# EAGLE board UCirKitBreadboardBottom3 (EAGLE 7.3.0), part 1 of 3
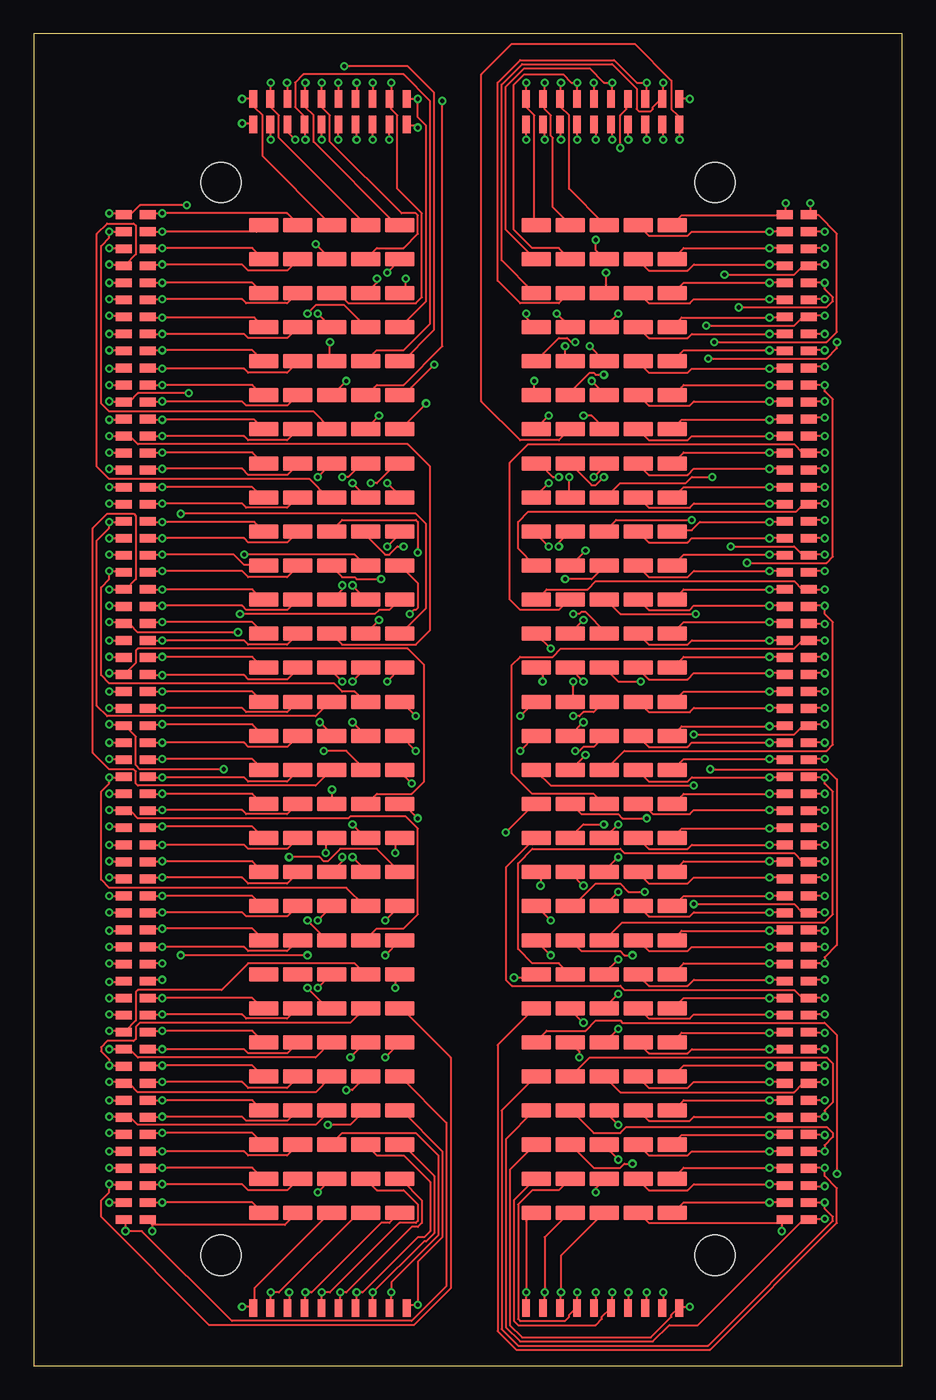
[diagram p5: board, top side]
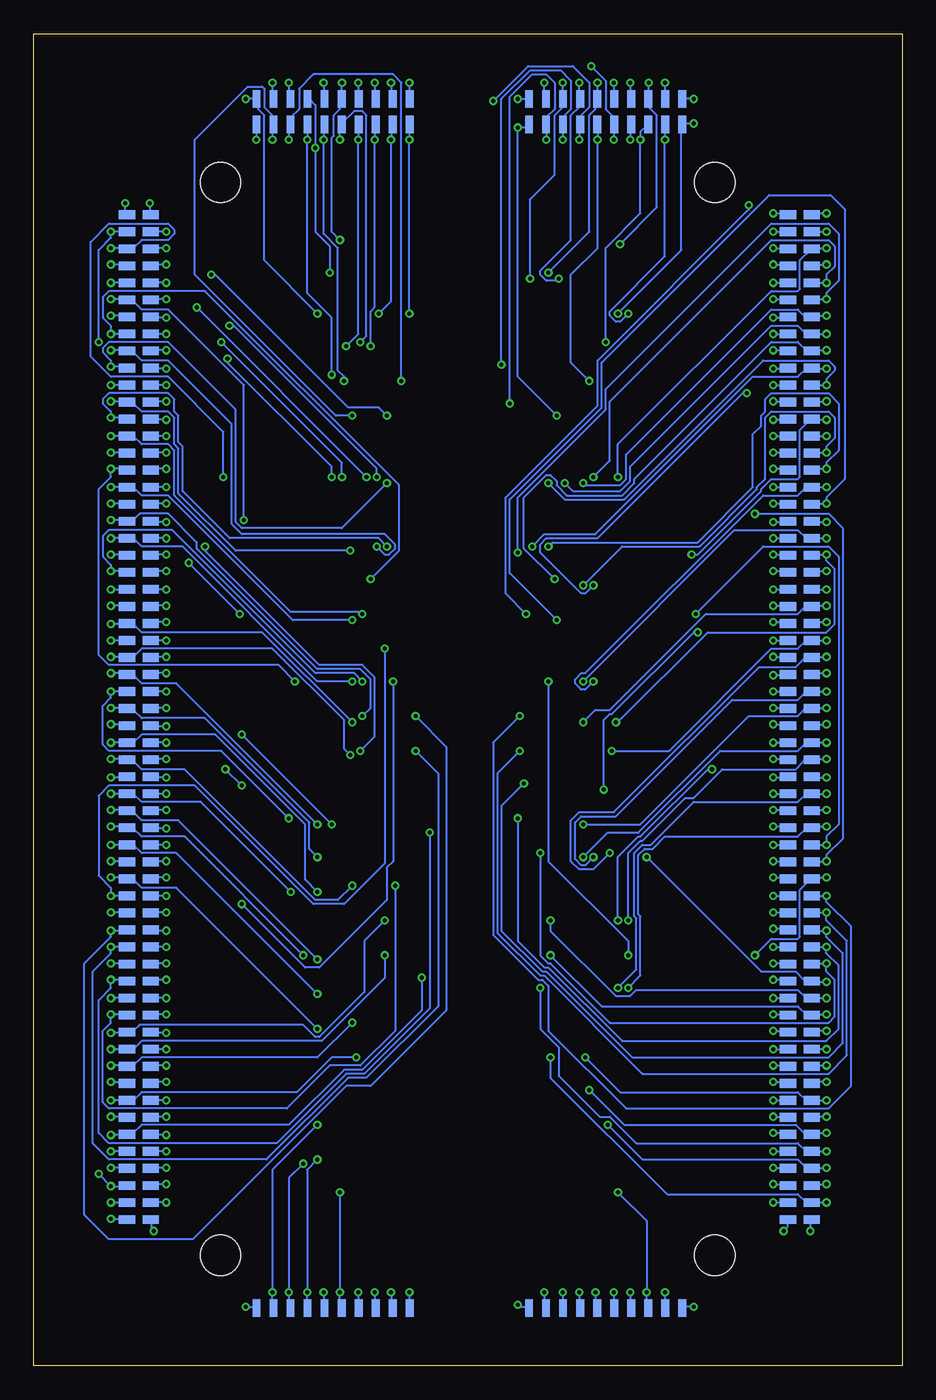
[diagram p6: board, bottom side, seen from below]

Size 64.75 x 99.36 mm. Coordinates in mm from the lower left corner, seen from the top.
Outline: 0,0 64.75,0 64.75,99.36 0,99.36 0,0
Copper layers (1*16): Top 0.035mm / dielectric 1.5mm / Bottom 0.035mm
Design rules "SeeedStudio_2layer_DRU_no_angle_20140221": minimum track width 6mil, minimum drill 12mil, track to track 6mil, track to pad 6mil, pad to pad 6mil, via to via 6mil, smd to smd 0mil, copper to edge 10mil, drill to drill 10mil, minimum pad ring 10mil, minimum via ring 6mil, stop-mask expansion 2mil, vias tented up to drill 100mil, thermal gap 10mil
Holes 3 mm at 13.97,88.27 50.8,88.27 13.97,8.26 50.8,8.26

## Footprints (pad centres in the part's own frame; a part is rotated, then mirrored left to right if it is on the bottom)
1X01_SMD_2.18X1.0668MM_NO_SILK = smd 2.184 x 1.067: P$2 0,0
1X01_SMD_1.27X0.635MM_NO_SILK = smd 1.27 x 0.635: P$2 0,0

## Placement (x,y rotation side)
JP301  [1X01_SMD_2.18X1.0668MM_NO_SILK]  17.14,85.09 0 top
JP302  [1X01_SMD_2.18X1.0668MM_NO_SILK]  19.68,85.09 0 top
JP303  [1X01_SMD_2.18X1.0668MM_NO_SILK]  22.23,85.09 0 top
JP304  [1X01_SMD_2.18X1.0668MM_NO_SILK]  24.77,85.09 0 top
JP305  [1X01_SMD_2.18X1.0668MM_NO_SILK]  27.3,85.09 0 top
JP306  [1X01_SMD_2.18X1.0668MM_NO_SILK]  37.47,85.09 0 top
JP307  [1X01_SMD_2.18X1.0668MM_NO_SILK]  40.01,85.09 0 top
JP308  [1X01_SMD_2.18X1.0668MM_NO_SILK]  42.55,85.09 0 top
JP309  [1X01_SMD_2.18X1.0668MM_NO_SILK]  45.09,85.09 0 top
JP310  [1X01_SMD_2.18X1.0668MM_NO_SILK]  47.62,85.09 0 top
JP311  [1X01_SMD_2.18X1.0668MM_NO_SILK]  17.14,82.55 0 top
JP312  [1X01_SMD_2.18X1.0668MM_NO_SILK]  19.68,82.55 0 top
JP313  [1X01_SMD_2.18X1.0668MM_NO_SILK]  22.23,82.55 0 top
JP314  [1X01_SMD_2.18X1.0668MM_NO_SILK]  24.77,82.55 0 top
JP315  [1X01_SMD_2.18X1.0668MM_NO_SILK]  27.3,82.55 0 top
JP316  [1X01_SMD_2.18X1.0668MM_NO_SILK]  37.47,82.55 0 top
JP317  [1X01_SMD_2.18X1.0668MM_NO_SILK]  40.01,82.55 0 top
JP318  [1X01_SMD_2.18X1.0668MM_NO_SILK]  42.55,82.55 0 top
JP319  [1X01_SMD_2.18X1.0668MM_NO_SILK]  45.09,82.55 0 top
JP320  [1X01_SMD_2.18X1.0668MM_NO_SILK]  47.62,82.55 0 top
JP321  [1X01_SMD_2.18X1.0668MM_NO_SILK]  17.14,80.01 0 top
JP322  [1X01_SMD_2.18X1.0668MM_NO_SILK]  19.68,80.01 0 top
JP323  [1X01_SMD_2.18X1.0668MM_NO_SILK]  22.23,80.01 0 top
JP324  [1X01_SMD_2.18X1.0668MM_NO_SILK]  24.77,80.01 0 top
JP325  [1X01_SMD_2.18X1.0668MM_NO_SILK]  27.3,80.01 0 top
JP326  [1X01_SMD_2.18X1.0668MM_NO_SILK]  37.47,80.01 0 top
JP327  [1X01_SMD_2.18X1.0668MM_NO_SILK]  40.01,80.01 0 top
JP328  [1X01_SMD_2.18X1.0668MM_NO_SILK]  42.55,80.01 0 top
JP329  [1X01_SMD_2.18X1.0668MM_NO_SILK]  45.09,80.01 0 top
JP330  [1X01_SMD_2.18X1.0668MM_NO_SILK]  47.62,80.01 0 top
JP331  [1X01_SMD_2.18X1.0668MM_NO_SILK]  17.14,77.47 0 top
JP332  [1X01_SMD_2.18X1.0668MM_NO_SILK]  19.68,77.47 0 top
JP333  [1X01_SMD_2.18X1.0668MM_NO_SILK]  22.23,77.47 0 top
JP334  [1X01_SMD_2.18X1.0668MM_NO_SILK]  24.77,77.47 0 top
JP335  [1X01_SMD_2.18X1.0668MM_NO_SILK]  27.3,77.47 0 top
JP336  [1X01_SMD_2.18X1.0668MM_NO_SILK]  37.47,77.47 0 top
JP337  [1X01_SMD_2.18X1.0668MM_NO_SILK]  40.01,77.47 0 top
JP338  [1X01_SMD_2.18X1.0668MM_NO_SILK]  42.55,77.47 0 top
JP339  [1X01_SMD_2.18X1.0668MM_NO_SILK]  45.09,77.47 0 top
JP340  [1X01_SMD_2.18X1.0668MM_NO_SILK]  47.62,77.47 0 top
JP341  [1X01_SMD_2.18X1.0668MM_NO_SILK]  17.14,74.93 0 top
JP342  [1X01_SMD_2.18X1.0668MM_NO_SILK]  19.68,74.93 0 top
JP343  [1X01_SMD_2.18X1.0668MM_NO_SILK]  22.23,74.93 0 top
JP344  [1X01_SMD_2.18X1.0668MM_NO_SILK]  24.77,74.93 0 top
JP345  [1X01_SMD_2.18X1.0668MM_NO_SILK]  27.3,74.93 0 top
JP346  [1X01_SMD_2.18X1.0668MM_NO_SILK]  37.47,74.93 0 top
JP347  [1X01_SMD_2.18X1.0668MM_NO_SILK]  40.01,74.93 0 top
JP348  [1X01_SMD_2.18X1.0668MM_NO_SILK]  42.55,74.93 0 top
JP349  [1X01_SMD_2.18X1.0668MM_NO_SILK]  45.09,74.93 0 top
JP350  [1X01_SMD_2.18X1.0668MM_NO_SILK]  47.62,74.93 0 top
JP351  [1X01_SMD_2.18X1.0668MM_NO_SILK]  17.14,72.39 0 top
JP352  [1X01_SMD_2.18X1.0668MM_NO_SILK]  19.68,72.39 0 top
JP353  [1X01_SMD_2.18X1.0668MM_NO_SILK]  22.23,72.39 0 top
JP354  [1X01_SMD_2.18X1.0668MM_NO_SILK]  24.77,72.39 0 top
JP355  [1X01_SMD_2.18X1.0668MM_NO_SILK]  27.3,72.39 0 top
JP356  [1X01_SMD_2.18X1.0668MM_NO_SILK]  37.47,72.39 0 top
JP357  [1X01_SMD_2.18X1.0668MM_NO_SILK]  40.01,72.39 0 top
JP358  [1X01_SMD_2.18X1.0668MM_NO_SILK]  42.55,72.39 0 top
JP359  [1X01_SMD_2.18X1.0668MM_NO_SILK]  45.09,72.39 0 top
JP360  [1X01_SMD_2.18X1.0668MM_NO_SILK]  47.62,72.39 0 top
JP361  [1X01_SMD_2.18X1.0668MM_NO_SILK]  17.14,69.85 0 top
JP362  [1X01_SMD_2.18X1.0668MM_NO_SILK]  19.68,69.85 0 top
JP363  [1X01_SMD_2.18X1.0668MM_NO_SILK]  22.23,69.85 0 top
JP364  [1X01_SMD_2.18X1.0668MM_NO_SILK]  24.77,69.85 0 top
JP365  [1X01_SMD_2.18X1.0668MM_NO_SILK]  27.3,69.85 0 top
JP366  [1X01_SMD_2.18X1.0668MM_NO_SILK]  37.47,69.85 0 top
JP367  [1X01_SMD_2.18X1.0668MM_NO_SILK]  40.01,69.85 0 top
JP368  [1X01_SMD_2.18X1.0668MM_NO_SILK]  42.55,69.85 0 top
JP369  [1X01_SMD_2.18X1.0668MM_NO_SILK]  45.09,69.85 0 top
JP370  [1X01_SMD_2.18X1.0668MM_NO_SILK]  47.62,69.85 0 top
JP371  [1X01_SMD_2.18X1.0668MM_NO_SILK]  17.14,67.31 0 top
JP372  [1X01_SMD_2.18X1.0668MM_NO_SILK]  19.68,67.31 0 top
JP373  [1X01_SMD_2.18X1.0668MM_NO_SILK]  22.23,67.31 0 top
JP374  [1X01_SMD_2.18X1.0668MM_NO_SILK]  24.77,67.31 0 top
JP375  [1X01_SMD_2.18X1.0668MM_NO_SILK]  27.3,67.31 0 top
JP376  [1X01_SMD_2.18X1.0668MM_NO_SILK]  37.47,67.31 0 top
JP377  [1X01_SMD_2.18X1.0668MM_NO_SILK]  40.01,67.31 0 top
JP378  [1X01_SMD_2.18X1.0668MM_NO_SILK]  42.55,67.31 0 top
JP379  [1X01_SMD_2.18X1.0668MM_NO_SILK]  45.09,67.31 0 top
JP380  [1X01_SMD_2.18X1.0668MM_NO_SILK]  47.62,67.31 0 top
JP381  [1X01_SMD_2.18X1.0668MM_NO_SILK]  17.14,64.77 0 top
JP382  [1X01_SMD_2.18X1.0668MM_NO_SILK]  19.68,64.77 0 top
JP383  [1X01_SMD_2.18X1.0668MM_NO_SILK]  22.23,64.77 0 top
JP384  [1X01_SMD_2.18X1.0668MM_NO_SILK]  24.77,64.77 0 top
JP385  [1X01_SMD_2.18X1.0668MM_NO_SILK]  27.3,64.77 0 top
JP386  [1X01_SMD_2.18X1.0668MM_NO_SILK]  37.47,64.77 0 top
JP387  [1X01_SMD_2.18X1.0668MM_NO_SILK]  40.01,64.77 0 top
JP388  [1X01_SMD_2.18X1.0668MM_NO_SILK]  42.55,64.77 0 top
JP389  [1X01_SMD_2.18X1.0668MM_NO_SILK]  45.09,64.77 0 top
JP390  [1X01_SMD_2.18X1.0668MM_NO_SILK]  47.62,64.77 0 top
JP391  [1X01_SMD_2.18X1.0668MM_NO_SILK]  17.14,62.23 0 top
JP392  [1X01_SMD_2.18X1.0668MM_NO_SILK]  19.68,62.23 0 top
JP393  [1X01_SMD_2.18X1.0668MM_NO_SILK]  22.23,62.23 0 top
JP394  [1X01_SMD_2.18X1.0668MM_NO_SILK]  24.77,62.23 0 top
JP395  [1X01_SMD_2.18X1.0668MM_NO_SILK]  27.3,62.23 0 top
JP396  [1X01_SMD_2.18X1.0668MM_NO_SILK]  37.47,62.23 0 top
JP397  [1X01_SMD_2.18X1.0668MM_NO_SILK]  40.01,62.23 0 top
JP398  [1X01_SMD_2.18X1.0668MM_NO_SILK]  42.55,62.23 0 top
JP399  [1X01_SMD_2.18X1.0668MM_NO_SILK]  45.09,62.23 0 top
JP400  [1X01_SMD_2.18X1.0668MM_NO_SILK]  47.62,62.23 0 top
JP401  [1X01_SMD_2.18X1.0668MM_NO_SILK]  17.14,59.69 0 top
JP402  [1X01_SMD_2.18X1.0668MM_NO_SILK]  19.68,59.69 0 top
JP403  [1X01_SMD_2.18X1.0668MM_NO_SILK]  22.23,59.69 0 top
JP404  [1X01_SMD_2.18X1.0668MM_NO_SILK]  24.77,59.69 0 top
JP405  [1X01_SMD_2.18X1.0668MM_NO_SILK]  27.3,59.69 0 top
JP406  [1X01_SMD_2.18X1.0668MM_NO_SILK]  37.47,59.69 0 top
JP407  [1X01_SMD_2.18X1.0668MM_NO_SILK]  40.01,59.69 0 top
JP408  [1X01_SMD_2.18X1.0668MM_NO_SILK]  42.55,59.69 0 top
JP409  [1X01_SMD_2.18X1.0668MM_NO_SILK]  45.09,59.69 0 top
JP410  [1X01_SMD_2.18X1.0668MM_NO_SILK]  47.62,59.69 0 top
JP411  [1X01_SMD_2.18X1.0668MM_NO_SILK]  17.14,57.15 0 top
JP412  [1X01_SMD_2.18X1.0668MM_NO_SILK]  19.68,57.15 0 top
JP413  [1X01_SMD_2.18X1.0668MM_NO_SILK]  22.23,57.15 0 top
JP414  [1X01_SMD_2.18X1.0668MM_NO_SILK]  24.77,57.15 0 top
JP415  [1X01_SMD_2.18X1.0668MM_NO_SILK]  27.3,57.15 0 top
JP416  [1X01_SMD_2.18X1.0668MM_NO_SILK]  37.47,57.15 0 top
JP417  [1X01_SMD_2.18X1.0668MM_NO_SILK]  40.01,57.15 0 top
JP418  [1X01_SMD_2.18X1.0668MM_NO_SILK]  42.55,57.15 0 top
JP419  [1X01_SMD_2.18X1.0668MM_NO_SILK]  45.09,57.15 0 top
JP420  [1X01_SMD_2.18X1.0668MM_NO_SILK]  47.62,57.15 0 top
JP421  [1X01_SMD_2.18X1.0668MM_NO_SILK]  17.14,54.61 0 top
JP422  [1X01_SMD_2.18X1.0668MM_NO_SILK]  19.68,54.61 0 top
JP423  [1X01_SMD_2.18X1.0668MM_NO_SILK]  22.23,54.61 0 top
JP424  [1X01_SMD_2.18X1.0668MM_NO_SILK]  24.77,54.61 0 top
JP425  [1X01_SMD_2.18X1.0668MM_NO_SILK]  27.3,54.61 0 top
JP426  [1X01_SMD_2.18X1.0668MM_NO_SILK]  37.47,54.61 0 top
JP427  [1X01_SMD_2.18X1.0668MM_NO_SILK]  40.01,54.61 0 top
JP428  [1X01_SMD_2.18X1.0668MM_NO_SILK]  42.55,54.61 0 top
JP429  [1X01_SMD_2.18X1.0668MM_NO_SILK]  45.09,54.61 0 top
JP430  [1X01_SMD_2.18X1.0668MM_NO_SILK]  47.62,54.61 0 top
JP431  [1X01_SMD_2.18X1.0668MM_NO_SILK]  17.14,52.07 0 top
JP432  [1X01_SMD_2.18X1.0668MM_NO_SILK]  19.68,52.07 0 top
JP433  [1X01_SMD_2.18X1.0668MM_NO_SILK]  22.23,52.07 0 top
JP434  [1X01_SMD_2.18X1.0668MM_NO_SILK]  24.77,52.07 0 top
JP435  [1X01_SMD_2.18X1.0668MM_NO_SILK]  27.3,52.07 0 top
JP436  [1X01_SMD_2.18X1.0668MM_NO_SILK]  37.47,52.07 0 top
JP437  [1X01_SMD_2.18X1.0668MM_NO_SILK]  40.01,52.07 0 top
JP438  [1X01_SMD_2.18X1.0668MM_NO_SILK]  42.55,52.07 0 top
JP439  [1X01_SMD_2.18X1.0668MM_NO_SILK]  45.09,52.07 0 top
JP440  [1X01_SMD_2.18X1.0668MM_NO_SILK]  47.62,52.07 0 top
JP441  [1X01_SMD_2.18X1.0668MM_NO_SILK]  17.14,49.53 0 top
JP442  [1X01_SMD_2.18X1.0668MM_NO_SILK]  19.68,49.53 0 top
JP443  [1X01_SMD_2.18X1.0668MM_NO_SILK]  22.23,49.53 0 top
JP444  [1X01_SMD_2.18X1.0668MM_NO_SILK]  24.77,49.53 0 top
JP445  [1X01_SMD_2.18X1.0668MM_NO_SILK]  27.3,49.53 0 top
JP446  [1X01_SMD_2.18X1.0668MM_NO_SILK]  37.47,49.53 0 top
JP447  [1X01_SMD_2.18X1.0668MM_NO_SILK]  40.01,49.53 0 top
JP448  [1X01_SMD_2.18X1.0668MM_NO_SILK]  42.55,49.53 0 top
JP449  [1X01_SMD_2.18X1.0668MM_NO_SILK]  45.09,49.53 0 top
JP450  [1X01_SMD_2.18X1.0668MM_NO_SILK]  47.62,49.53 0 top
JP451  [1X01_SMD_2.18X1.0668MM_NO_SILK]  17.14,46.99 0 top
JP452  [1X01_SMD_2.18X1.0668MM_NO_SILK]  19.68,46.99 0 top
JP453  [1X01_SMD_2.18X1.0668MM_NO_SILK]  22.23,46.99 0 top
JP454  [1X01_SMD_2.18X1.0668MM_NO_SILK]  24.77,46.99 0 top
JP455  [1X01_SMD_2.18X1.0668MM_NO_SILK]  27.3,46.99 0 top
JP456  [1X01_SMD_2.18X1.0668MM_NO_SILK]  37.47,46.99 0 top
JP457  [1X01_SMD_2.18X1.0668MM_NO_SILK]  40.01,46.99 0 top
JP458  [1X01_SMD_2.18X1.0668MM_NO_SILK]  42.55,46.99 0 top
JP459  [1X01_SMD_2.18X1.0668MM_NO_SILK]  45.09,46.99 0 top
JP460  [1X01_SMD_2.18X1.0668MM_NO_SILK]  47.62,46.99 0 top
JP461  [1X01_SMD_2.18X1.0668MM_NO_SILK]  17.14,44.45 0 top
JP462  [1X01_SMD_2.18X1.0668MM_NO_SILK]  19.68,44.45 0 top
JP463  [1X01_SMD_2.18X1.0668MM_NO_SILK]  22.23,44.45 0 top
JP464  [1X01_SMD_2.18X1.0668MM_NO_SILK]  24.77,44.45 0 top
JP465  [1X01_SMD_2.18X1.0668MM_NO_SILK]  27.3,44.45 0 top
JP466  [1X01_SMD_2.18X1.0668MM_NO_SILK]  37.47,44.45 0 top
JP467  [1X01_SMD_2.18X1.0668MM_NO_SILK]  40.01,44.45 0 top
JP468  [1X01_SMD_2.18X1.0668MM_NO_SILK]  42.55,44.45 0 top
JP469  [1X01_SMD_2.18X1.0668MM_NO_SILK]  45.09,44.45 0 top
JP470  [1X01_SMD_2.18X1.0668MM_NO_SILK]  47.62,44.45 0 top
JP471  [1X01_SMD_2.18X1.0668MM_NO_SILK]  17.14,41.91 0 top
JP472  [1X01_SMD_2.18X1.0668MM_NO_SILK]  19.68,41.91 0 top
JP473  [1X01_SMD_2.18X1.0668MM_NO_SILK]  22.23,41.91 0 top
JP474  [1X01_SMD_2.18X1.0668MM_NO_SILK]  24.77,41.91 0 top
JP475  [1X01_SMD_2.18X1.0668MM_NO_SILK]  27.3,41.91 0 top
JP476  [1X01_SMD_2.18X1.0668MM_NO_SILK]  37.47,41.91 0 top
JP477  [1X01_SMD_2.18X1.0668MM_NO_SILK]  40.01,41.91 0 top
JP478  [1X01_SMD_2.18X1.0668MM_NO_SILK]  42.55,41.91 0 top
JP479  [1X01_SMD_2.18X1.0668MM_NO_SILK]  45.09,41.91 0 top
JP480  [1X01_SMD_2.18X1.0668MM_NO_SILK]  47.62,41.91 0 top
JP481  [1X01_SMD_2.18X1.0668MM_NO_SILK]  17.14,39.37 0 top
JP482  [1X01_SMD_2.18X1.0668MM_NO_SILK]  19.68,39.37 0 top
JP483  [1X01_SMD_2.18X1.0668MM_NO_SILK]  22.23,39.37 0 top
JP484  [1X01_SMD_2.18X1.0668MM_NO_SILK]  24.77,39.37 0 top
JP485  [1X01_SMD_2.18X1.0668MM_NO_SILK]  27.3,39.37 0 top
JP486  [1X01_SMD_2.18X1.0668MM_NO_SILK]  37.47,39.37 0 top
JP487  [1X01_SMD_2.18X1.0668MM_NO_SILK]  40.01,39.37 0 top
JP488  [1X01_SMD_2.18X1.0668MM_NO_SILK]  42.55,39.37 0 top
JP489  [1X01_SMD_2.18X1.0668MM_NO_SILK]  45.09,39.37 0 top
JP490  [1X01_SMD_2.18X1.0668MM_NO_SILK]  47.62,39.37 0 top
JP491  [1X01_SMD_2.18X1.0668MM_NO_SILK]  17.14,36.83 0 top
JP492  [1X01_SMD_2.18X1.0668MM_NO_SILK]  19.68,36.83 0 top
JP493  [1X01_SMD_2.18X1.0668MM_NO_SILK]  22.23,36.83 0 top
JP494  [1X01_SMD_2.18X1.0668MM_NO_SILK]  24.77,36.83 0 top
JP495  [1X01_SMD_2.18X1.0668MM_NO_SILK]  27.3,36.83 0 top
JP496  [1X01_SMD_2.18X1.0668MM_NO_SILK]  37.47,36.83 0 top
JP497  [1X01_SMD_2.18X1.0668MM_NO_SILK]  40.01,36.83 0 top
JP498  [1X01_SMD_2.18X1.0668MM_NO_SILK]  42.55,36.83 0 top
JP499  [1X01_SMD_2.18X1.0668MM_NO_SILK]  45.09,36.83 0 top
JP500  [1X01_SMD_2.18X1.0668MM_NO_SILK]  47.62,36.83 0 top
JP501  [1X01_SMD_2.18X1.0668MM_NO_SILK]  17.14,34.29 0 top
JP502  [1X01_SMD_2.18X1.0668MM_NO_SILK]  19.68,34.29 0 top
JP503  [1X01_SMD_2.18X1.0668MM_NO_SILK]  22.23,34.29 0 top
JP504  [1X01_SMD_2.18X1.0668MM_NO_SILK]  24.77,34.29 0 top
JP505  [1X01_SMD_2.18X1.0668MM_NO_SILK]  27.3,34.29 0 top
JP506  [1X01_SMD_2.18X1.0668MM_NO_SILK]  37.47,34.29 0 top
JP507  [1X01_SMD_2.18X1.0668MM_NO_SILK]  40.01,34.29 0 top
JP508  [1X01_SMD_2.18X1.0668MM_NO_SILK]  42.55,34.29 0 top
JP509  [1X01_SMD_2.18X1.0668MM_NO_SILK]  45.09,34.29 0 top
JP510  [1X01_SMD_2.18X1.0668MM_NO_SILK]  47.62,34.29 0 top
JP511  [1X01_SMD_2.18X1.0668MM_NO_SILK]  17.14,31.75 0 top
JP512  [1X01_SMD_2.18X1.0668MM_NO_SILK]  19.68,31.75 0 top
JP513  [1X01_SMD_2.18X1.0668MM_NO_SILK]  22.23,31.75 0 top
JP514  [1X01_SMD_2.18X1.0668MM_NO_SILK]  24.77,31.75 0 top
JP515  [1X01_SMD_2.18X1.0668MM_NO_SILK]  27.3,31.75 0 top
JP516  [1X01_SMD_2.18X1.0668MM_NO_SILK]  37.47,31.75 0 top
JP517  [1X01_SMD_2.18X1.0668MM_NO_SILK]  40.01,31.75 0 top
JP518  [1X01_SMD_2.18X1.0668MM_NO_SILK]  42.55,31.75 0 top
JP519  [1X01_SMD_2.18X1.0668MM_NO_SILK]  45.09,31.75 0 top
JP520  [1X01_SMD_2.18X1.0668MM_NO_SILK]  47.62,31.75 0 top
JP521  [1X01_SMD_2.18X1.0668MM_NO_SILK]  17.14,29.21 0 top
JP522  [1X01_SMD_2.18X1.0668MM_NO_SILK]  19.68,29.21 0 top
JP523  [1X01_SMD_2.18X1.0668MM_NO_SILK]  22.23,29.21 0 top
JP524  [1X01_SMD_2.18X1.0668MM_NO_SILK]  24.77,29.21 0 top
JP525  [1X01_SMD_2.18X1.0668MM_NO_SILK]  27.3,29.21 0 top
JP526  [1X01_SMD_2.18X1.0668MM_NO_SILK]  37.47,29.21 0 top
JP527  [1X01_SMD_2.18X1.0668MM_NO_SILK]  40.01,29.21 0 top
JP528  [1X01_SMD_2.18X1.0668MM_NO_SILK]  42.55,29.21 0 top
JP529  [1X01_SMD_2.18X1.0668MM_NO_SILK]  45.09,29.21 0 top
JP530  [1X01_SMD_2.18X1.0668MM_NO_SILK]  47.62,29.21 0 top
JP531  [1X01_SMD_2.18X1.0668MM_NO_SILK]  17.14,26.67 0 top
JP532  [1X01_SMD_2.18X1.0668MM_NO_SILK]  19.68,26.67 0 top
JP533  [1X01_SMD_2.18X1.0668MM_NO_SILK]  22.23,26.67 0 top
JP534  [1X01_SMD_2.18X1.0668MM_NO_SILK]  24.77,26.67 0 top
JP535  [1X01_SMD_2.18X1.0668MM_NO_SILK]  27.3,26.67 0 top
JP536  [1X01_SMD_2.18X1.0668MM_NO_SILK]  37.47,26.67 0 top
JP537  [1X01_SMD_2.18X1.0668MM_NO_SILK]  40.01,26.67 0 top
JP538  [1X01_SMD_2.18X1.0668MM_NO_SILK]  42.55,26.67 0 top
JP539  [1X01_SMD_2.18X1.0668MM_NO_SILK]  45.09,26.67 0 top
JP540  [1X01_SMD_2.18X1.0668MM_NO_SILK]  47.62,26.67 0 top
JP541  [1X01_SMD_2.18X1.0668MM_NO_SILK]  17.14,24.13 0 top
JP542  [1X01_SMD_2.18X1.0668MM_NO_SILK]  19.68,24.13 0 top
JP543  [1X01_SMD_2.18X1.0668MM_NO_SILK]  22.23,24.13 0 top
JP544  [1X01_SMD_2.18X1.0668MM_NO_SILK]  24.77,24.13 0 top
JP545  [1X01_SMD_2.18X1.0668MM_NO_SILK]  27.3,24.13 0 top
JP546  [1X01_SMD_2.18X1.0668MM_NO_SILK]  37.47,24.13 0 top
JP547  [1X01_SMD_2.18X1.0668MM_NO_SILK]  40.01,24.13 0 top
JP548  [1X01_SMD_2.18X1.0668MM_NO_SILK]  42.55,24.13 0 top
JP549  [1X01_SMD_2.18X1.0668MM_NO_SILK]  45.09,24.13 0 top
JP550  [1X01_SMD_2.18X1.0668MM_NO_SILK]  47.62,24.13 0 top
JP551  [1X01_SMD_2.18X1.0668MM_NO_SILK]  17.14,21.59 0 top
JP552  [1X01_SMD_2.18X1.0668MM_NO_SILK]  19.68,21.59 0 top
JP553  [1X01_SMD_2.18X1.0668MM_NO_SILK]  22.23,21.59 0 top
JP554  [1X01_SMD_2.18X1.0668MM_NO_SILK]  24.77,21.59 0 top
JP555  [1X01_SMD_2.18X1.0668MM_NO_SILK]  27.3,21.59 0 top
JP556  [1X01_SMD_2.18X1.0668MM_NO_SILK]  37.47,21.59 0 top
JP557  [1X01_SMD_2.18X1.0668MM_NO_SILK]  40.01,21.59 0 top
JP558  [1X01_SMD_2.18X1.0668MM_NO_SILK]  42.55,21.59 0 top
JP559  [1X01_SMD_2.18X1.0668MM_NO_SILK]  45.09,21.59 0 top
JP560  [1X01_SMD_2.18X1.0668MM_NO_SILK]  47.62,21.59 0 top
JP561  [1X01_SMD_2.18X1.0668MM_NO_SILK]  17.14,19.05 0 top
JP562  [1X01_SMD_2.18X1.0668MM_NO_SILK]  19.68,19.05 0 top
JP563  [1X01_SMD_2.18X1.0668MM_NO_SILK]  22.23,19.05 0 top
JP564  [1X01_SMD_2.18X1.0668MM_NO_SILK]  24.77,19.05 0 top
JP565  [1X01_SMD_2.18X1.0668MM_NO_SILK]  27.3,19.05 0 top
JP566  [1X01_SMD_2.18X1.0668MM_NO_SILK]  37.47,19.05 0 top
JP567  [1X01_SMD_2.18X1.0668MM_NO_SILK]  40.01,19.05 0 top
JP568  [1X01_SMD_2.18X1.0668MM_NO_SILK]  42.55,19.05 0 top
JP569  [1X01_SMD_2.18X1.0668MM_NO_SILK]  45.09,19.05 0 top
JP570  [1X01_SMD_2.18X1.0668MM_NO_SILK]  47.62,19.05 0 top
JP571  [1X01_SMD_2.18X1.0668MM_NO_SILK]  17.14,16.51 0 top
JP572  [1X01_SMD_2.18X1.0668MM_NO_SILK]  19.68,16.51 0 top
JP573  [1X01_SMD_2.18X1.0668MM_NO_SILK]  22.23,16.51 0 top
JP574  [1X01_SMD_2.18X1.0668MM_NO_SILK]  24.77,16.51 0 top
JP575  [1X01_SMD_2.18X1.0668MM_NO_SILK]  27.3,16.51 0 top
JP576  [1X01_SMD_2.18X1.0668MM_NO_SILK]  37.47,16.51 0 top
JP577  [1X01_SMD_2.18X1.0668MM_NO_SILK]  40.01,16.51 0 top
JP578  [1X01_SMD_2.18X1.0668MM_NO_SILK]  42.55,16.51 0 top
JP579  [1X01_SMD_2.18X1.0668MM_NO_SILK]  45.09,16.51 0 top
JP580  [1X01_SMD_2.18X1.0668MM_NO_SILK]  47.62,16.51 0 top
JP581  [1X01_SMD_2.18X1.0668MM_NO_SILK]  17.14,13.97 0 top
JP582  [1X01_SMD_2.18X1.0668MM_NO_SILK]  19.68,13.97 0 top
JP583  [1X01_SMD_2.18X1.0668MM_NO_SILK]  22.23,13.97 0 top
JP584  [1X01_SMD_2.18X1.0668MM_NO_SILK]  24.77,13.97 0 top
JP585  [1X01_SMD_2.18X1.0668MM_NO_SILK]  27.3,13.97 0 top
JP586  [1X01_SMD_2.18X1.0668MM_NO_SILK]  37.47,13.97 0 top
JP587  [1X01_SMD_2.18X1.0668MM_NO_SILK]  40.01,13.97 0 top
JP588  [1X01_SMD_2.18X1.0668MM_NO_SILK]  42.55,13.97 0 top
JP589  [1X01_SMD_2.18X1.0668MM_NO_SILK]  45.09,13.97 0 top
JP590  [1X01_SMD_2.18X1.0668MM_NO_SILK]  47.62,13.97 0 top
JP591  [1X01_SMD_2.18X1.0668MM_NO_SILK]  17.14,11.43 0 top
JP592  [1X01_SMD_2.18X1.0668MM_NO_SILK]  19.68,11.43 0 top
JP593  [1X01_SMD_2.18X1.0668MM_NO_SILK]  22.23,11.43 0 top
JP594  [1X01_SMD_2.18X1.0668MM_NO_SILK]  24.77,11.43 0 top
JP595  [1X01_SMD_2.18X1.0668MM_NO_SILK]  27.3,11.43 0 top
JP596  [1X01_SMD_2.18X1.0668MM_NO_SILK]  37.47,11.43 0 top
JP597  [1X01_SMD_2.18X1.0668MM_NO_SILK]  40.01,11.43 0 top
JP598  [1X01_SMD_2.18X1.0668MM_NO_SILK]  42.55,11.43 0 top
JP599  [1X01_SMD_2.18X1.0668MM_NO_SILK]  45.09,11.43 0 top
JP600  [1X01_SMD_2.18X1.0668MM_NO_SILK]  47.62,11.43 0 top
JP601  [1X01_SMD_1.27X0.635MM_NO_SILK]  6.73,85.85 0 top
JP602  [1X01_SMD_1.27X0.635MM_NO_SILK]  6.73,84.58 0 top
JP603  [1X01_SMD_1.27X0.635MM_NO_SILK]  6.73,83.31 0 top
JP604  [1X01_SMD_1.27X0.635MM_NO_SILK]  6.73,82.04 0 top
JP605  [1X01_SMD_1.27X0.635MM_NO_SILK]  6.73,80.77 0 top
JP606  [1X01_SMD_1.27X0.635MM_NO_SILK]  6.73,79.5 0 top
JP607  [1X01_SMD_1.27X0.635MM_NO_SILK]  6.73,78.23 0 top
JP608  [1X01_SMD_1.27X0.635MM_NO_SILK]  6.73,76.96 0 top
JP609  [1X01_SMD_1.27X0.635MM_NO_SILK]  6.73,75.69 0 top
JP610  [1X01_SMD_1.27X0.635MM_NO_SILK]  6.73,74.42 0 top
JP611  [1X01_SMD_1.27X0.635MM_NO_SILK]  6.73,73.15 0 top
JP612  [1X01_SMD_1.27X0.635MM_NO_SILK]  6.73,71.88 0 top
JP613  [1X01_SMD_1.27X0.635MM_NO_SILK]  6.73,70.61 0 top
JP614  [1X01_SMD_1.27X0.635MM_NO_SILK]  6.73,69.34 0 top
JP615  [1X01_SMD_1.27X0.635MM_NO_SILK]  6.73,68.07 0 top
JP616  [1X01_SMD_1.27X0.635MM_NO_SILK]  6.73,66.8 0 top
JP617  [1X01_SMD_1.27X0.635MM_NO_SILK]  6.73,65.53 0 top
JP618  [1X01_SMD_1.27X0.635MM_NO_SILK]  6.73,64.26 0 top
JP619  [1X01_SMD_1.27X0.635MM_NO_SILK]  6.73,62.99 0 top
JP620  [1X01_SMD_1.27X0.635MM_NO_SILK]  6.73,61.72 0 top
JP621  [1X01_SMD_1.27X0.635MM_NO_SILK]  6.73,60.45 0 top
JP622  [1X01_SMD_1.27X0.635MM_NO_SILK]  6.73,59.18 0 top
JP623  [1X01_SMD_1.27X0.635MM_NO_SILK]  6.73,57.91 0 top
JP624  [1X01_SMD_1.27X0.635MM_NO_SILK]  6.73,56.64 0 top
JP625  [1X01_SMD_1.27X0.635MM_NO_SILK]  6.73,55.37 0 top
JP626  [1X01_SMD_1.27X0.635MM_NO_SILK]  6.73,54.1 0 top
JP627  [1X01_SMD_1.27X0.635MM_NO_SILK]  6.73,52.83 0 top
JP628  [1X01_SMD_1.27X0.635MM_NO_SILK]  6.73,51.56 0 top
JP629  [1X01_SMD_1.27X0.635MM_NO_SILK]  6.73,50.29 0 top
JP630  [1X01_SMD_1.27X0.635MM_NO_SILK]  6.73,49.02 0 top
JP631  [1X01_SMD_1.27X0.635MM_NO_SILK]  6.73,47.75 0 top
JP632  [1X01_SMD_1.27X0.635MM_NO_SILK]  6.73,46.48 0 top
JP633  [1X01_SMD_1.27X0.635MM_NO_SILK]  6.73,45.21 0 top
JP634  [1X01_SMD_1.27X0.635MM_NO_SILK]  6.73,43.94 0 top
JP635  [1X01_SMD_1.27X0.635MM_NO_SILK]  6.73,42.67 0 top
JP636  [1X01_SMD_1.27X0.635MM_NO_SILK]  6.73,41.4 0 top
JP637  [1X01_SMD_1.27X0.635MM_NO_SILK]  6.73,40.13 0 top
JP638  [1X01_SMD_1.27X0.635MM_NO_SILK]  6.73,24.89 0 top
JP639  [1X01_SMD_1.27X0.635MM_NO_SILK]  6.73,23.62 0 top
JP640  [1X01_SMD_1.27X0.635MM_NO_SILK]  6.73,22.35 0 top
JP641  [1X01_SMD_1.27X0.635MM_NO_SILK]  6.73,21.08 0 top
JP642  [1X01_SMD_1.27X0.635MM_NO_SILK]  6.73,19.81 0 top
JP643  [1X01_SMD_1.27X0.635MM_NO_SILK]  6.73,18.54 0 top
JP644  [1X01_SMD_1.27X0.635MM_NO_SILK]  6.73,17.27 0 top
JP645  [1X01_SMD_1.27X0.635MM_NO_SILK]  6.73,16 0 top
JP646  [1X01_SMD_1.27X0.635MM_NO_SILK]  6.73,14.73 0 top
JP647  [1X01_SMD_1.27X0.635MM_NO_SILK]  6.73,13.46 0 top
JP648  [1X01_SMD_1.27X0.635MM_NO_SILK]  6.73,12.19 0 top
JP649  [1X01_SMD_1.27X0.635MM_NO_SILK]  6.73,10.92 0 top
JP650  [1X01_SMD_1.27X0.635MM_NO_SILK]  6.73,26.16 180 top
JP651  [1X01_SMD_1.27X0.635MM_NO_SILK]  6.73,27.43 180 top
JP652  [1X01_SMD_1.27X0.635MM_NO_SILK]  6.73,28.7 180 top
JP653  [1X01_SMD_1.27X0.635MM_NO_SILK]  6.73,29.97 180 top
JP654  [1X01_SMD_1.27X0.635MM_NO_SILK]  6.73,31.24 180 top
JP655  [1X01_SMD_1.27X0.635MM_NO_SILK]  6.73,32.51 180 top
JP656  [1X01_SMD_1.27X0.635MM_NO_SILK]  6.73,33.78 180 top
JP657  [1X01_SMD_1.27X0.635MM_NO_SILK]  6.73,35.05 180 top
JP658  [1X01_SMD_1.27X0.635MM_NO_SILK]  6.73,36.32 180 top
JP659  [1X01_SMD_1.27X0.635MM_NO_SILK]  6.73,37.59 180 top
JP660  [1X01_SMD_1.27X0.635MM_NO_SILK]  6.73,38.86 180 top
JP661  [1X01_SMD_1.27X0.635MM_NO_SILK]  8.51,85.85 0 top
JP662  [1X01_SMD_1.27X0.635MM_NO_SILK]  8.51,84.58 0 top
JP663  [1X01_SMD_1.27X0.635MM_NO_SILK]  8.51,83.31 0 top
JP664  [1X01_SMD_1.27X0.635MM_NO_SILK]  8.51,82.04 0 top
JP665  [1X01_SMD_1.27X0.635MM_NO_SILK]  8.51,80.77 0 top
JP666  [1X01_SMD_1.27X0.635MM_NO_SILK]  8.51,79.5 0 top
JP667  [1X01_SMD_1.27X0.635MM_NO_SILK]  8.51,78.23 0 top
JP668  [1X01_SMD_1.27X0.635MM_NO_SILK]  8.51,76.96 0 top
JP669  [1X01_SMD_1.27X0.635MM_NO_SILK]  8.51,75.69 0 top
JP670  [1X01_SMD_1.27X0.635MM_NO_SILK]  8.51,74.42 0 top
JP671  [1X01_SMD_1.27X0.635MM_NO_SILK]  8.51,73.15 0 top
JP672  [1X01_SMD_1.27X0.635MM_NO_SILK]  8.51,71.88 0 top
JP673  [1X01_SMD_1.27X0.635MM_NO_SILK]  8.51,70.61 0 top
JP674  [1X01_SMD_1.27X0.635MM_NO_SILK]  8.51,69.34 0 top
JP675  [1X01_SMD_1.27X0.635MM_NO_SILK]  8.51,68.07 0 top
JP676  [1X01_SMD_1.27X0.635MM_NO_SILK]  8.51,66.8 0 top
JP677  [1X01_SMD_1.27X0.635MM_NO_SILK]  8.51,65.53 0 top
JP678  [1X01_SMD_1.27X0.635MM_NO_SILK]  8.51,64.26 0 top
JP679  [1X01_SMD_1.27X0.635MM_NO_SILK]  8.51,62.99 0 top
JP680  [1X01_SMD_1.27X0.635MM_NO_SILK]  8.51,61.72 0 top
JP681  [1X01_SMD_1.27X0.635MM_NO_SILK]  8.51,60.45 0 top
JP682  [1X01_SMD_1.27X0.635MM_NO_SILK]  8.51,59.18 0 top
JP683  [1X01_SMD_1.27X0.635MM_NO_SILK]  8.51,57.91 0 top
JP684  [1X01_SMD_1.27X0.635MM_NO_SILK]  8.51,56.64 0 top
JP685  [1X01_SMD_1.27X0.635MM_NO_SILK]  8.51,55.37 0 top
JP686  [1X01_SMD_1.27X0.635MM_NO_SILK]  8.51,54.1 0 top
JP687  [1X01_SMD_1.27X0.635MM_NO_SILK]  8.51,52.83 0 top
JP688  [1X01_SMD_1.27X0.635MM_NO_SILK]  8.51,51.56 0 top
JP689  [1X01_SMD_1.27X0.635MM_NO_SILK]  8.51,50.29 0 top
JP690  [1X01_SMD_1.27X0.635MM_NO_SILK]  8.51,49.02 0 top
JP691  [1X01_SMD_1.27X0.635MM_NO_SILK]  8.51,47.75 0 top
JP692  [1X01_SMD_1.27X0.635MM_NO_SILK]  8.51,46.48 0 top
JP693  [1X01_SMD_1.27X0.635MM_NO_SILK]  8.51,45.21 0 top
JP694  [1X01_SMD_1.27X0.635MM_NO_SILK]  8.51,43.94 0 top
JP695  [1X01_SMD_1.27X0.635MM_NO_SILK]  8.51,42.67 0 top
JP696  [1X01_SMD_1.27X0.635MM_NO_SILK]  8.51,41.4 0 top
JP697  [1X01_SMD_1.27X0.635MM_NO_SILK]  8.51,40.13 0 top
JP698  [1X01_SMD_1.27X0.635MM_NO_SILK]  8.51,38.86 0 top
JP699  [1X01_SMD_1.27X0.635MM_NO_SILK]  8.51,37.59 0 top
JP700  [1X01_SMD_1.27X0.635MM_NO_SILK]  8.51,36.32 0 top
JP701  [1X01_SMD_1.27X0.635MM_NO_SILK]  8.51,35.05 0 top
JP702  [1X01_SMD_1.27X0.635MM_NO_SILK]  8.51,33.78 0 top
JP703  [1X01_SMD_1.27X0.635MM_NO_SILK]  8.51,32.51 0 top
JP704  [1X01_SMD_1.27X0.635MM_NO_SILK]  8.51,31.24 0 top
JP705  [1X01_SMD_1.27X0.635MM_NO_SILK]  8.51,29.97 0 top
JP706  [1X01_SMD_1.27X0.635MM_NO_SILK]  8.51,28.7 0 top
JP707  [1X01_SMD_1.27X0.635MM_NO_SILK]  8.51,27.43 0 top
JP708  [1X01_SMD_1.27X0.635MM_NO_SILK]  8.51,26.16 0 top
JP709  [1X01_SMD_1.27X0.635MM_NO_SILK]  8.51,24.89 0 top
JP710  [1X01_SMD_1.27X0.635MM_NO_SILK]  8.51,23.62 0 top
JP711  [1X01_SMD_1.27X0.635MM_NO_SILK]  8.51,22.35 0 top
JP712  [1X01_SMD_1.27X0.635MM_NO_SILK]  8.51,21.08 0 top
JP713  [1X01_SMD_1.27X0.635MM_NO_SILK]  8.51,19.81 0 top
JP714  [1X01_SMD_1.27X0.635MM_NO_SILK]  8.51,18.54 0 top
JP715  [1X01_SMD_1.27X0.635MM_NO_SILK]  8.51,17.27 0 top
JP716  [1X01_SMD_1.27X0.635MM_NO_SILK]  8.51,16 0 top
JP717  [1X01_SMD_1.27X0.635MM_NO_SILK]  8.51,14.73 0 top
JP718  [1X01_SMD_1.27X0.635MM_NO_SILK]  8.51,13.46 0 top
JP719  [1X01_SMD_1.27X0.635MM_NO_SILK]  8.51,12.19 0 top
JP720  [1X01_SMD_1.27X0.635MM_NO_SILK]  8.51,10.92 0 top
JP721  [1X01_SMD_1.27X0.635MM_NO_SILK]  56.01,85.85 0 top
JP722  [1X01_SMD_1.27X0.635MM_NO_SILK]  56.01,84.58 0 top
JP723  [1X01_SMD_1.27X0.635MM_NO_SILK]  56.01,83.31 0 top
JP724  [1X01_SMD_1.27X0.635MM_NO_SILK]  56.01,82.04 0 top
JP725  [1X01_SMD_1.27X0.635MM_NO_SILK]  56.01,80.77 0 top
JP726  [1X01_SMD_1.27X0.635MM_NO_SILK]  56.01,79.5 0 top
JP727  [1X01_SMD_1.27X0.635MM_NO_SILK]  56.01,78.23 0 top
JP728  [1X01_SMD_1.27X0.635MM_NO_SILK]  56.01,76.96 0 top
JP729  [1X01_SMD_1.27X0.635MM_NO_SILK]  56.01,75.69 0 top
JP730  [1X01_SMD_1.27X0.635MM_NO_SILK]  56.01,74.42 0 top
JP731  [1X01_SMD_1.27X0.635MM_NO_SILK]  56.01,73.15 0 top
JP732  [1X01_SMD_1.27X0.635MM_NO_SILK]  56.01,71.88 0 top
JP733  [1X01_SMD_1.27X0.635MM_NO_SILK]  56.01,70.61 0 top
JP734  [1X01_SMD_1.27X0.635MM_NO_SILK]  56.01,69.34 0 top
JP735  [1X01_SMD_1.27X0.635MM_NO_SILK]  56.01,68.07 0 top
JP736  [1X01_SMD_1.27X0.635MM_NO_SILK]  56.01,66.8 0 top
JP737  [1X01_SMD_1.27X0.635MM_NO_SILK]  56.01,65.53 0 top
JP738  [1X01_SMD_1.27X0.635MM_NO_SILK]  56.01,64.26 0 top
JP739  [1X01_SMD_1.27X0.635MM_NO_SILK]  56.01,62.99 0 top
JP740  [1X01_SMD_1.27X0.635MM_NO_SILK]  56.01,61.72 0 top
JP741  [1X01_SMD_1.27X0.635MM_NO_SILK]  56.01,60.45 0 top
JP742  [1X01_SMD_1.27X0.635MM_NO_SILK]  56.01,59.18 0 top
JP743  [1X01_SMD_1.27X0.635MM_NO_SILK]  56.01,57.91 0 top
JP744  [1X01_SMD_1.27X0.635MM_NO_SILK]  56.01,56.64 0 top
JP745  [1X01_SMD_1.27X0.635MM_NO_SILK]  56.01,55.37 0 top
JP746  [1X01_SMD_1.27X0.635MM_NO_SILK]  56.01,54.1 0 top
JP747  [1X01_SMD_1.27X0.635MM_NO_SILK]  56.01,52.83 0 top
JP748  [1X01_SMD_1.27X0.635MM_NO_SILK]  56.01,51.56 0 top
JP749  [1X01_SMD_1.27X0.635MM_NO_SILK]  56.01,50.29 0 top
JP750  [1X01_SMD_1.27X0.635MM_NO_SILK]  56.01,49.02 0 top
JP751  [1X01_SMD_1.27X0.635MM_NO_SILK]  56.01,47.75 0 top
JP752  [1X01_SMD_1.27X0.635MM_NO_SILK]  56.01,46.48 0 top
JP753  [1X01_SMD_1.27X0.635MM_NO_SILK]  56.01,45.21 0 top
JP754  [1X01_SMD_1.27X0.635MM_NO_SILK]  56.01,43.94 0 top
JP755  [1X01_SMD_1.27X0.635MM_NO_SILK]  56.01,42.67 0 top
JP756  [1X01_SMD_1.27X0.635MM_NO_SILK]  56.01,41.4 0 top
JP757  [1X01_SMD_1.27X0.635MM_NO_SILK]  56.01,40.13 0 top
JP758  [1X01_SMD_1.27X0.635MM_NO_SILK]  56.01,38.86 0 top
JP759  [1X01_SMD_1.27X0.635MM_NO_SILK]  56.01,37.59 0 top
JP760  [1X01_SMD_1.27X0.635MM_NO_SILK]  56.01,36.32 0 top
JP761  [1X01_SMD_1.27X0.635MM_NO_SILK]  56.01,35.05 0 top
JP762  [1X01_SMD_1.27X0.635MM_NO_SILK]  56.01,33.78 0 top
JP763  [1X01_SMD_1.27X0.635MM_NO_SILK]  56.01,32.51 0 top
JP764  [1X01_SMD_1.27X0.635MM_NO_SILK]  56.01,31.24 0 top
JP765  [1X01_SMD_1.27X0.635MM_NO_SILK]  56.01,29.97 0 top
JP766  [1X01_SMD_1.27X0.635MM_NO_SILK]  56.01,28.7 0 top
JP767  [1X01_SMD_1.27X0.635MM_NO_SILK]  56.01,27.43 0 top
JP768  [1X01_SMD_1.27X0.635MM_NO_SILK]  56.01,26.16 0 top
JP769  [1X01_SMD_1.27X0.635MM_NO_SILK]  56.01,24.89 0 top
JP770  [1X01_SMD_1.27X0.635MM_NO_SILK]  56.01,23.62 0 top
JP771  [1X01_SMD_1.27X0.635MM_NO_SILK]  56.01,22.35 0 top
JP772  [1X01_SMD_1.27X0.635MM_NO_SILK]  56.01,21.08 0 top
JP773  [1X01_SMD_1.27X0.635MM_NO_SILK]  56.01,19.81 0 top
JP774  [1X01_SMD_1.27X0.635MM_NO_SILK]  56.01,18.54 0 top
JP775  [1X01_SMD_1.27X0.635MM_NO_SILK]  56.01,17.27 0 top
JP776  [1X01_SMD_1.27X0.635MM_NO_SILK]  56.01,16 0 top
JP777  [1X01_SMD_1.27X0.635MM_NO_SILK]  56.01,14.73 0 top
JP778  [1X01_SMD_1.27X0.635MM_NO_SILK]  56.01,13.46 0 top
JP779  [1X01_SMD_1.27X0.635MM_NO_SILK]  56.01,12.19 0 top
JP780  [1X01_SMD_1.27X0.635MM_NO_SILK]  56.01,10.92 0 top
JP781  [1X01_SMD_1.27X0.635MM_NO_SILK]  57.78,85.85 0 top
JP782  [1X01_SMD_1.27X0.635MM_NO_SILK]  57.78,84.58 0 top
JP783  [1X01_SMD_1.27X0.635MM_NO_SILK]  57.78,83.31 0 top
JP784  [1X01_SMD_1.27X0.635MM_NO_SILK]  57.78,82.04 0 top
JP785  [1X01_SMD_1.27X0.635MM_NO_SILK]  57.78,80.77 0 top
JP786  [1X01_SMD_1.27X0.635MM_NO_SILK]  57.78,79.5 0 top
JP787  [1X01_SMD_1.27X0.635MM_NO_SILK]  57.78,78.23 0 top
JP788  [1X01_SMD_1.27X0.635MM_NO_SILK]  57.78,76.96 0 top
JP789  [1X01_SMD_1.27X0.635MM_NO_SILK]  57.78,75.69 0 top
JP790  [1X01_SMD_1.27X0.635MM_NO_SILK]  57.78,74.42 0 top
JP791  [1X01_SMD_1.27X0.635MM_NO_SILK]  57.78,73.15 0 top
JP792  [1X01_SMD_1.27X0.635MM_NO_SILK]  57.78,71.88 0 top
JP793  [1X01_SMD_1.27X0.635MM_NO_SILK]  57.78,70.61 0 top
JP794  [1X01_SMD_1.27X0.635MM_NO_SILK]  57.78,69.34 0 top
JP795  [1X01_SMD_1.27X0.635MM_NO_SILK]  57.78,68.07 0 top
JP796  [1X01_SMD_1.27X0.635MM_NO_SILK]  57.78,66.8 0 top
JP797  [1X01_SMD_1.27X0.635MM_NO_SILK]  57.78,65.53 0 top
JP798  [1X01_SMD_1.27X0.635MM_NO_SILK]  57.78,64.26 0 top
JP799  [1X01_SMD_1.27X0.635MM_NO_SILK]  57.78,62.99 0 top
JP800  [1X01_SMD_1.27X0.635MM_NO_SILK]  57.78,61.72 0 top
JP801  [1X01_SMD_1.27X0.635MM_NO_SILK]  57.78,60.45 0 top
JP802  [1X01_SMD_1.27X0.635MM_NO_SILK]  57.78,59.18 0 top
JP803  [1X01_SMD_1.27X0.635MM_NO_SILK]  57.78,57.91 0 top
JP804  [1X01_SMD_1.27X0.635MM_NO_SILK]  57.78,56.64 0 top
JP805  [1X01_SMD_1.27X0.635MM_NO_SILK]  57.78,55.37 0 top
JP806  [1X01_SMD_1.27X0.635MM_NO_SILK]  57.78,54.1 0 top
JP807  [1X01_SMD_1.27X0.635MM_NO_SILK]  57.78,52.83 0 top
JP808  [1X01_SMD_1.27X0.635MM_NO_SILK]  57.78,51.56 0 top
JP809  [1X01_SMD_1.27X0.635MM_NO_SILK]  57.78,50.29 0 top
JP810  [1X01_SMD_1.27X0.635MM_NO_SILK]  57.78,49.02 0 top
JP811  [1X01_SMD_1.27X0.635MM_NO_SILK]  57.78,47.75 0 top
JP812  [1X01_SMD_1.27X0.635MM_NO_SILK]  57.78,46.48 0 top
JP813  [1X01_SMD_1.27X0.635MM_NO_SILK]  57.78,45.21 0 top
JP814  [1X01_SMD_1.27X0.635MM_NO_SILK]  57.78,43.94 0 top
JP815  [1X01_SMD_1.27X0.635MM_NO_SILK]  57.78,42.67 0 top
JP816  [1X01_SMD_1.27X0.635MM_NO_SILK]  57.78,41.4 0 top
JP817  [1X01_SMD_1.27X0.635MM_NO_SILK]  57.78,40.13 0 top
JP818  [1X01_SMD_1.27X0.635MM_NO_SILK]  57.78,38.86 0 top
JP819  [1X01_SMD_1.27X0.635MM_NO_SILK]  57.78,37.59 0 top
JP820  [1X01_SMD_1.27X0.635MM_NO_SILK]  57.78,36.32 0 top
JP821  [1X01_SMD_1.27X0.635MM_NO_SILK]  57.78,22.35 0 top
JP822  [1X01_SMD_1.27X0.635MM_NO_SILK]  57.78,21.08 0 top
JP823  [1X01_SMD_1.27X0.635MM_NO_SILK]  57.78,19.81 0 top
JP824  [1X01_SMD_1.27X0.635MM_NO_SILK]  57.78,18.54 0 top
JP825  [1X01_SMD_1.27X0.635MM_NO_SILK]  57.78,17.27 0 top
JP826  [1X01_SMD_1.27X0.635MM_NO_SILK]  57.78,16 0 top
JP827  [1X01_SMD_1.27X0.635MM_NO_SILK]  57.78,14.73 0 top
JP828  [1X01_SMD_1.27X0.635MM_NO_SILK]  57.78,13.46 0 top
JP829  [1X01_SMD_1.27X0.635MM_NO_SILK]  57.78,12.19 0 top
JP830  [1X01_SMD_1.27X0.635MM_NO_SILK]  57.78,10.92 0 top
JP831  [1X01_SMD_1.27X0.635MM_NO_SILK]  57.78,23.62 180 top
JP832  [1X01_SMD_1.27X0.635MM_NO_SILK]  57.78,24.89 180 top
JP833  [1X01_SMD_1.27X0.635MM_NO_SILK]  57.78,26.16 180 top
JP834  [1X01_SMD_1.27X0.635MM_NO_SILK]  57.78,27.43 180 top
JP835  [1X01_SMD_1.27X0.635MM_NO_SILK]  57.78,28.7 180 top
JP836  [1X01_SMD_1.27X0.635MM_NO_SILK]  57.78,29.97 180 top
JP837  [1X01_SMD_1.27X0.635MM_NO_SILK]  57.78,31.24 180 top
JP838  [1X01_SMD_1.27X0.635MM_NO_SILK]  57.78,32.51 180 top
JP839  [1X01_SMD_1.27X0.635MM_NO_SILK]  57.78,33.78 180 top
JP840  [1X01_SMD_1.27X0.635MM_NO_SILK]  57.78,35.05 180 top
JP841  [1X01_SMD_1.27X0.635MM_NO_SILK]  16.38,94.49 90 top
JP842  [1X01_SMD_1.27X0.635MM_NO_SILK]  17.65,94.49 90 top
JP843  [1X01_SMD_1.27X0.635MM_NO_SILK]  18.92,94.49 90 top
JP844  [1X01_SMD_1.27X0.635MM_NO_SILK]  20.19,94.49 90 top
JP845  [1X01_SMD_1.27X0.635MM_NO_SILK]  21.46,94.49 90 top
JP846  [1X01_SMD_1.27X0.635MM_NO_SILK]  22.73,94.49 90 top
JP847  [1X01_SMD_1.27X0.635MM_NO_SILK]  24,94.49 90 top
JP848  [1X01_SMD_1.27X0.635MM_NO_SILK]  25.27,94.49 90 top
JP849  [1X01_SMD_1.27X0.635MM_NO_SILK]  26.54,94.49 90 top
JP850  [1X01_SMD_1.27X0.635MM_NO_SILK]  27.81,94.49 90 top
JP851  [1X01_SMD_1.27X0.635MM_NO_SILK]  16.38,92.58 90 top
JP852  [1X01_SMD_1.27X0.635MM_NO_SILK]  17.65,92.58 90 top
JP853  [1X01_SMD_1.27X0.635MM_NO_SILK]  18.92,92.58 90 top
JP854  [1X01_SMD_1.27X0.635MM_NO_SILK]  20.19,92.58 90 top
JP855  [1X01_SMD_1.27X0.635MM_NO_SILK]  21.46,92.58 90 top
JP856  [1X01_SMD_1.27X0.635MM_NO_SILK]  22.73,92.58 90 top
JP857  [1X01_SMD_1.27X0.635MM_NO_SILK]  24,92.58 90 top
JP858  [1X01_SMD_1.27X0.635MM_NO_SILK]  25.27,92.58 90 top
JP859  [1X01_SMD_1.27X0.635MM_NO_SILK]  26.54,92.58 90 top
JP860  [1X01_SMD_1.27X0.635MM_NO_SILK]  27.81,92.58 90 top
JP861  [1X01_SMD_1.27X0.635MM_NO_SILK]  36.7,94.49 90 top
JP862  [1X01_SMD_1.27X0.635MM_NO_SILK]  37.97,94.49 90 top
JP863  [1X01_SMD_1.27X0.635MM_NO_SILK]  39.24,94.49 90 top
JP864  [1X01_SMD_1.27X0.635MM_NO_SILK]  40.51,94.49 90 top
JP865  [1X01_SMD_1.27X0.635MM_NO_SILK]  41.78,94.49 90 top
JP866  [1X01_SMD_1.27X0.635MM_NO_SILK]  43.05,94.49 90 top
JP867  [1X01_SMD_1.27X0.635MM_NO_SILK]  44.32,94.49 90 top
JP868  [1X01_SMD_1.27X0.635MM_NO_SILK]  45.59,94.49 90 top
JP869  [1X01_SMD_1.27X0.635MM_NO_SILK]  46.86,94.49 90 top
JP870  [1X01_SMD_1.27X0.635MM_NO_SILK]  48.13,94.49 90 top
JP871  [1X01_SMD_1.27X0.635MM_NO_SILK]  36.7,92.58 90 top
JP872  [1X01_SMD_1.27X0.635MM_NO_SILK]  37.97,92.58 90 top
JP873  [1X01_SMD_1.27X0.635MM_NO_SILK]  39.24,92.58 90 top
JP874  [1X01_SMD_1.27X0.635MM_NO_SILK]  40.51,92.58 90 top
JP875  [1X01_SMD_1.27X0.635MM_NO_SILK]  41.78,92.58 90 top
JP876  [1X01_SMD_1.27X0.635MM_NO_SILK]  43.05,92.58 90 top
JP877  [1X01_SMD_1.27X0.635MM_NO_SILK]  44.32,92.58 90 top
JP878  [1X01_SMD_1.27X0.635MM_NO_SILK]  45.59,92.58 90 top
JP879  [1X01_SMD_1.27X0.635MM_NO_SILK]  46.86,92.58 90 top
JP880  [1X01_SMD_1.27X0.635MM_NO_SILK]  48.13,92.58 90 top
JP881  [1X01_SMD_1.27X0.635MM_NO_SILK]  16.38,4.32 90 top
JP882  [1X01_SMD_1.27X0.635MM_NO_SILK]  17.65,4.32 90 top
JP883  [1X01_SMD_1.27X0.635MM_NO_SILK]  18.92,4.32 90 top
JP884  [1X01_SMD_1.27X0.635MM_NO_SILK]  20.19,4.32 90 top
JP885  [1X01_SMD_1.27X0.635MM_NO_SILK]  21.46,4.32 90 top
JP886  [1X01_SMD_1.27X0.635MM_NO_SILK]  22.73,4.32 90 top
JP887  [1X01_SMD_1.27X0.635MM_NO_SILK]  24,4.32 90 top
JP888  [1X01_SMD_1.27X0.635MM_NO_SILK]  25.27,4.32 90 top
JP889  [1X01_SMD_1.27X0.635MM_NO_SILK]  26.54,4.32 90 top
JP890  [1X01_SMD_1.27X0.635MM_NO_SILK]  27.81,4.32 90 top
JP891  [1X01_SMD_1.27X0.635MM_NO_SILK]  36.7,4.32 90 top
JP892  [1X01_SMD_1.27X0.635MM_NO_SILK]  37.97,4.32 90 top
JP893  [1X01_SMD_1.27X0.635MM_NO_SILK]  39.24,4.32 90 top
JP894  [1X01_SMD_1.27X0.635MM_NO_SILK]  40.51,4.32 90 top
JP895  [1X01_SMD_1.27X0.635MM_NO_SILK]  41.78,4.32 90 top
JP896  [1X01_SMD_1.27X0.635MM_NO_SILK]  43.05,4.32 90 top
JP897  [1X01_SMD_1.27X0.635MM_NO_SILK]  44.32,4.32 90 top
JP898  [1X01_SMD_1.27X0.635MM_NO_SILK]  45.59,4.32 90 top
JP899  [1X01_SMD_1.27X0.635MM_NO_SILK]  46.86,4.32 90 top
JP900  [1X01_SMD_1.27X0.635MM_NO_SILK]  48.13,4.32 90 top
JP901  [1X01_SMD_1.27X0.635MM_NO_SILK]  6.73,85.85 0 bottom
JP902  [1X01_SMD_1.27X0.635MM_NO_SILK]  6.73,84.58 0 bottom
JP903  [1X01_SMD_1.27X0.635MM_NO_SILK]  6.73,83.31 0 bottom
JP904  [1X01_SMD_1.27X0.635MM_NO_SILK]  6.73,82.04 0 bottom
JP905  [1X01_SMD_1.27X0.635MM_NO_SILK]  6.73,80.77 0 bottom
JP906  [1X01_SMD_1.27X0.635MM_NO_SILK]  6.73,79.5 0 bottom
JP907  [1X01_SMD_1.27X0.635MM_NO_SILK]  6.73,78.23 0 bottom
JP908  [1X01_SMD_1.27X0.635MM_NO_SILK]  6.73,76.96 0 bottom
JP909  [1X01_SMD_1.27X0.635MM_NO_SILK]  6.73,75.69 0 bottom
JP910  [1X01_SMD_1.27X0.635MM_NO_SILK]  6.73,74.42 0 bottom
JP911  [1X01_SMD_1.27X0.635MM_NO_SILK]  6.73,73.15 0 bottom
JP912  [1X01_SMD_1.27X0.635MM_NO_SILK]  6.73,71.88 0 bottom
JP913  [1X01_SMD_1.27X0.635MM_NO_SILK]  6.73,70.61 0 bottom
JP914  [1X01_SMD_1.27X0.635MM_NO_SILK]  6.73,69.34 0 bottom
JP915  [1X01_SMD_1.27X0.635MM_NO_SILK]  6.73,68.07 0 bottom
JP916  [1X01_SMD_1.27X0.635MM_NO_SILK]  6.73,66.8 0 bottom
JP917  [1X01_SMD_1.27X0.635MM_NO_SILK]  6.73,65.53 0 bottom
JP918  [1X01_SMD_1.27X0.635MM_NO_SILK]  6.73,64.26 0 bottom
JP919  [1X01_SMD_1.27X0.635MM_NO_SILK]  6.73,62.99 0 bottom
JP920  [1X01_SMD_1.27X0.635MM_NO_SILK]  6.73,61.72 0 bottom
JP921  [1X01_SMD_1.27X0.635MM_NO_SILK]  6.73,60.45 0 bottom
JP922  [1X01_SMD_1.27X0.635MM_NO_SILK]  6.73,59.18 0 bottom
JP923  [1X01_SMD_1.27X0.635MM_NO_SILK]  6.73,57.91 0 bottom
JP924  [1X01_SMD_1.27X0.635MM_NO_SILK]  6.73,56.64 0 bottom
JP925  [1X01_SMD_1.27X0.635MM_NO_SILK]  6.73,55.37 0 bottom
JP926  [1X01_SMD_1.27X0.635MM_NO_SILK]  6.73,54.1 0 bottom
JP927  [1X01_SMD_1.27X0.635MM_NO_SILK]  6.73,52.83 0 bottom
JP928  [1X01_SMD_1.27X0.635MM_NO_SILK]  6.73,51.56 0 bottom
JP929  [1X01_SMD_1.27X0.635MM_NO_SILK]  6.73,50.29 0 bottom
JP930  [1X01_SMD_1.27X0.635MM_NO_SILK]  6.73,49.02 0 bottom
JP931  [1X01_SMD_1.27X0.635MM_NO_SILK]  6.73,47.75 0 bottom
JP932  [1X01_SMD_1.27X0.635MM_NO_SILK]  6.73,46.48 0 bottom
JP933  [1X01_SMD_1.27X0.635MM_NO_SILK]  6.73,45.21 0 bottom
JP934  [1X01_SMD_1.27X0.635MM_NO_SILK]  6.73,43.94 0 bottom
JP935  [1X01_SMD_1.27X0.635MM_NO_SILK]  6.73,42.67 0 bottom
JP936  [1X01_SMD_1.27X0.635MM_NO_SILK]  6.73,41.4 0 bottom
JP937  [1X01_SMD_1.27X0.635MM_NO_SILK]  6.73,40.13 0 bottom
JP938  [1X01_SMD_1.27X0.635MM_NO_SILK]  6.73,24.89 0 bottom
JP939  [1X01_SMD_1.27X0.635MM_NO_SILK]  6.73,23.62 0 bottom
JP940  [1X01_SMD_1.27X0.635MM_NO_SILK]  6.73,22.35 0 bottom
JP941  [1X01_SMD_1.27X0.635MM_NO_SILK]  6.73,21.08 0 bottom
JP942  [1X01_SMD_1.27X0.635MM_NO_SILK]  6.73,19.81 0 bottom
JP943  [1X01_SMD_1.27X0.635MM_NO_SILK]  6.73,18.54 0 bottom
JP944  [1X01_SMD_1.27X0.635MM_NO_SILK]  6.73,17.27 0 bottom
JP945  [1X01_SMD_1.27X0.635MM_NO_SILK]  6.73,16 0 bottom
JP946  [1X01_SMD_1.27X0.635MM_NO_SILK]  6.73,14.73 0 bottom
JP947  [1X01_SMD_1.27X0.635MM_NO_SILK]  6.73,13.46 0 bottom
JP948  [1X01_SMD_1.27X0.635MM_NO_SILK]  6.73,12.19 0 bottom
JP949  [1X01_SMD_1.27X0.635MM_NO_SILK]  6.73,10.92 0 bottom
JP950  [1X01_SMD_1.27X0.635MM_NO_SILK]  6.73,26.16 180 bottom
JP951  [1X01_SMD_1.27X0.635MM_NO_SILK]  6.73,27.43 180 bottom
JP952  [1X01_SMD_1.27X0.635MM_NO_SILK]  6.73,28.7 180 bottom
JP953  [1X01_SMD_1.27X0.635MM_NO_SILK]  6.73,29.97 180 bottom
JP954  [1X01_SMD_1.27X0.635MM_NO_SILK]  6.73,31.24 180 bottom
JP955  [1X01_SMD_1.27X0.635MM_NO_SILK]  6.73,32.51 180 bottom
JP956  [1X01_SMD_1.27X0.635MM_NO_SILK]  6.73,33.78 180 bottom
JP957  [1X01_SMD_1.27X0.635MM_NO_SILK]  6.73,35.05 180 bottom
JP958  [1X01_SMD_1.27X0.635MM_NO_SILK]  6.73,36.32 180 bottom
JP959  [1X01_SMD_1.27X0.635MM_NO_SILK]  6.73,37.59 180 bottom
JP960  [1X01_SMD_1.27X0.635MM_NO_SILK]  6.73,38.86 180 bottom
JP961  [1X01_SMD_1.27X0.635MM_NO_SILK]  8.51,85.85 0 bottom
JP962  [1X01_SMD_1.27X0.635MM_NO_SILK]  8.51,84.58 0 bottom
JP963  [1X01_SMD_1.27X0.635MM_NO_SILK]  8.51,83.31 0 bottom
JP964  [1X01_SMD_1.27X0.635MM_NO_SILK]  8.51,82.04 0 bottom
JP965  [1X01_SMD_1.27X0.635MM_NO_SILK]  8.51,80.77 0 bottom
JP966  [1X01_SMD_1.27X0.635MM_NO_SILK]  8.51,79.5 0 bottom
JP967  [1X01_SMD_1.27X0.635MM_NO_SILK]  8.51,78.23 0 bottom
JP968  [1X01_SMD_1.27X0.635MM_NO_SILK]  8.51,76.96 0 bottom
JP969  [1X01_SMD_1.27X0.635MM_NO_SILK]  8.51,75.69 0 bottom
JP970  [1X01_SMD_1.27X0.635MM_NO_SILK]  8.51,74.42 0 bottom
JP971  [1X01_SMD_1.27X0.635MM_NO_SILK]  8.51,73.15 0 bottom
JP972  [1X01_SMD_1.27X0.635MM_NO_SILK]  8.51,71.88 0 bottom
JP973  [1X01_SMD_1.27X0.635MM_NO_SILK]  8.51,70.61 0 bottom
JP974  [1X01_SMD_1.27X0.635MM_NO_SILK]  8.51,69.34 0 bottom
JP975  [1X01_SMD_1.27X0.635MM_NO_SILK]  8.51,68.07 0 bottom
JP976  [1X01_SMD_1.27X0.635MM_NO_SILK]  8.51,66.8 0 bottom
JP977  [1X01_SMD_1.27X0.635MM_NO_SILK]  8.51,65.53 0 bottom
JP978  [1X01_SMD_1.27X0.635MM_NO_SILK]  8.51,64.26 0 bottom
JP979  [1X01_SMD_1.27X0.635MM_NO_SILK]  8.51,62.99 0 bottom
JP980  [1X01_SMD_1.27X0.635MM_NO_SILK]  8.51,61.72 0 bottom
JP981  [1X01_SMD_1.27X0.635MM_NO_SILK]  8.51,60.45 0 bottom
JP982  [1X01_SMD_1.27X0.635MM_NO_SILK]  8.51,59.18 0 bottom
JP983  [1X01_SMD_1.27X0.635MM_NO_SILK]  8.51,57.91 0 bottom
JP984  [1X01_SMD_1.27X0.635MM_NO_SILK]  8.51,56.64 0 bottom
JP985  [1X01_SMD_1.27X0.635MM_NO_SILK]  8.51,55.37 0 bottom
JP986  [1X01_SMD_1.27X0.635MM_NO_SILK]  8.51,54.1 0 bottom
JP987  [1X01_SMD_1.27X0.635MM_NO_SILK]  8.51,52.83 0 bottom
JP988  [1X01_SMD_1.27X0.635MM_NO_SILK]  8.51,51.56 0 bottom
JP989  [1X01_SMD_1.27X0.635MM_NO_SILK]  8.51,50.29 0 bottom
JP990  [1X01_SMD_1.27X0.635MM_NO_SILK]  8.51,49.02 0 bottom
JP991  [1X01_SMD_1.27X0.635MM_NO_SILK]  8.51,47.75 0 bottom
JP992  [1X01_SMD_1.27X0.635MM_NO_SILK]  8.51,46.48 0 bottom
JP993  [1X01_SMD_1.27X0.635MM_NO_SILK]  8.51,45.21 0 bottom
JP994  [1X01_SMD_1.27X0.635MM_NO_SILK]  8.51,43.94 0 bottom
JP995  [1X01_SMD_1.27X0.635MM_NO_SILK]  8.51,42.67 0 bottom
JP996  [1X01_SMD_1.27X0.635MM_NO_SILK]  8.51,41.4 0 bottom
JP997  [1X01_SMD_1.27X0.635MM_NO_SILK]  8.51,40.13 0 bottom
JP998  [1X01_SMD_1.27X0.635MM_NO_SILK]  8.51,38.86 0 bottom
JP999  [1X01_SMD_1.27X0.635MM_NO_SILK]  8.51,37.59 0 bottom
JP1000  [1X01_SMD_1.27X0.635MM_NO_SILK]  8.51,36.32 0 bottom
JP1001  [1X01_SMD_1.27X0.635MM_NO_SILK]  8.51,35.05 0 bottom
JP1002  [1X01_SMD_1.27X0.635MM_NO_SILK]  8.51,33.78 0 bottom
JP1003  [1X01_SMD_1.27X0.635MM_NO_SILK]  8.51,32.51 0 bottom
JP1004  [1X01_SMD_1.27X0.635MM_NO_SILK]  8.51,31.24 0 bottom
JP1005  [1X01_SMD_1.27X0.635MM_NO_SILK]  8.51,29.97 0 bottom
JP1006  [1X01_SMD_1.27X0.635MM_NO_SILK]  8.51,28.7 0 bottom
JP1007  [1X01_SMD_1.27X0.635MM_NO_SILK]  8.51,27.43 0 bottom
JP1008  [1X01_SMD_1.27X0.635MM_NO_SILK]  8.51,26.16 0 bottom
JP1009  [1X01_SMD_1.27X0.635MM_NO_SILK]  8.51,24.89 0 bottom
JP1010  [1X01_SMD_1.27X0.635MM_NO_SILK]  8.51,23.62 0 bottom
JP1011  [1X01_SMD_1.27X0.635MM_NO_SILK]  8.51,22.35 0 bottom
JP1012  [1X01_SMD_1.27X0.635MM_NO_SILK]  8.51,21.08 0 bottom
JP1013  [1X01_SMD_1.27X0.635MM_NO_SILK]  8.51,19.81 0 bottom
JP1014  [1X01_SMD_1.27X0.635MM_NO_SILK]  8.51,18.54 0 bottom
JP1015  [1X01_SMD_1.27X0.635MM_NO_SILK]  8.51,17.27 0 bottom
JP1016  [1X01_SMD_1.27X0.635MM_NO_SILK]  8.51,16 0 bottom
JP1017  [1X01_SMD_1.27X0.635MM_NO_SILK]  8.51,14.73 0 bottom
JP1018  [1X01_SMD_1.27X0.635MM_NO_SILK]  8.51,13.46 0 bottom
JP1019  [1X01_SMD_1.27X0.635MM_NO_SILK]  8.51,12.19 0 bottom
JP1020  [1X01_SMD_1.27X0.635MM_NO_SILK]  8.51,10.92 0 bottom
JP1021  [1X01_SMD_1.27X0.635MM_NO_SILK]  56.01,85.85 0 bottom
JP1022  [1X01_SMD_1.27X0.635MM_NO_SILK]  56.01,84.58 0 bottom
JP1023  [1X01_SMD_1.27X0.635MM_NO_SILK]  56.01,83.31 0 bottom
JP1024  [1X01_SMD_1.27X0.635MM_NO_SILK]  56.01,82.04 0 bottom
JP1025  [1X01_SMD_1.27X0.635MM_NO_SILK]  56.01,80.77 0 bottom
JP1026  [1X01_SMD_1.27X0.635MM_NO_SILK]  56.01,79.5 0 bottom
JP1027  [1X01_SMD_1.27X0.635MM_NO_SILK]  56.01,78.23 0 bottom
JP1028  [1X01_SMD_1.27X0.635MM_NO_SILK]  56.01,76.96 0 bottom
JP1029  [1X01_SMD_1.27X0.635MM_NO_SILK]  56.01,75.69 0 bottom
JP1030  [1X01_SMD_1.27X0.635MM_NO_SILK]  56.01,74.42 0 bottom
JP1031  [1X01_SMD_1.27X0.635MM_NO_SILK]  56.01,73.15 0 bottom
JP1032  [1X01_SMD_1.27X0.635MM_NO_SILK]  56.01,71.88 0 bottom
JP1033  [1X01_SMD_1.27X0.635MM_NO_SILK]  56.01,70.61 0 bottom
JP1034  [1X01_SMD_1.27X0.635MM_NO_SILK]  56.01,69.34 0 bottom
JP1035  [1X01_SMD_1.27X0.635MM_NO_SILK]  56.01,68.07 0 bottom
JP1036  [1X01_SMD_1.27X0.635MM_NO_SILK]  56.01,66.8 0 bottom
JP1037  [1X01_SMD_1.27X0.635MM_NO_SILK]  56.01,65.53 0 bottom
JP1038  [1X01_SMD_1.27X0.635MM_NO_SILK]  56.01,64.26 0 bottom
JP1039  [1X01_SMD_1.27X0.635MM_NO_SILK]  56.01,62.99 0 bottom
JP1040  [1X01_SMD_1.27X0.635MM_NO_SILK]  56.01,61.72 0 bottom
JP1041  [1X01_SMD_1.27X0.635MM_NO_SILK]  56.01,60.45 0 bottom
JP1042  [1X01_SMD_1.27X0.635MM_NO_SILK]  56.01,59.18 0 bottom
JP1043  [1X01_SMD_1.27X0.635MM_NO_SILK]  56.01,57.91 0 bottom
JP1044  [1X01_SMD_1.27X0.635MM_NO_SILK]  56.01,56.64 0 bottom
JP1045  [1X01_SMD_1.27X0.635MM_NO_SILK]  56.01,55.37 0 bottom
JP1046  [1X01_SMD_1.27X0.635MM_NO_SILK]  56.01,54.1 0 bottom
JP1047  [1X01_SMD_1.27X0.635MM_NO_SILK]  56.01,52.83 0 bottom
JP1048  [1X01_SMD_1.27X0.635MM_NO_SILK]  56.01,51.56 0 bottom
JP1049  [1X01_SMD_1.27X0.635MM_NO_SILK]  56.01,50.29 0 bottom
JP1050  [1X01_SMD_1.27X0.635MM_NO_SILK]  56.01,49.02 0 bottom
JP1051  [1X01_SMD_1.27X0.635MM_NO_SILK]  56.01,47.75 0 bottom
JP1052  [1X01_SMD_1.27X0.635MM_NO_SILK]  56.01,46.48 0 bottom
JP1053  [1X01_SMD_1.27X0.635MM_NO_SILK]  56.01,45.21 0 bottom
JP1054  [1X01_SMD_1.27X0.635MM_NO_SILK]  56.01,43.94 0 bottom
JP1055  [1X01_SMD_1.27X0.635MM_NO_SILK]  56.01,42.67 0 bottom
JP1056  [1X01_SMD_1.27X0.635MM_NO_SILK]  56.01,41.4 0 bottom
JP1057  [1X01_SMD_1.27X0.635MM_NO_SILK]  56.01,40.13 0 bottom
JP1058  [1X01_SMD_1.27X0.635MM_NO_SILK]  56.01,38.86 0 bottom
JP1059  [1X01_SMD_1.27X0.635MM_NO_SILK]  56.01,37.59 0 bottom
JP1060  [1X01_SMD_1.27X0.635MM_NO_SILK]  56.01,36.32 0 bottom
JP1061  [1X01_SMD_1.27X0.635MM_NO_SILK]  56.01,35.05 0 bottom
JP1062  [1X01_SMD_1.27X0.635MM_NO_SILK]  56.01,33.78 0 bottom
JP1063  [1X01_SMD_1.27X0.635MM_NO_SILK]  56.01,32.51 0 bottom
JP1064  [1X01_SMD_1.27X0.635MM_NO_SILK]  56.01,31.24 0 bottom
JP1065  [1X01_SMD_1.27X0.635MM_NO_SILK]  56.01,29.97 0 bottom
JP1066  [1X01_SMD_1.27X0.635MM_NO_SILK]  56.01,28.7 0 bottom
JP1067  [1X01_SMD_1.27X0.635MM_NO_SILK]  56.01,27.43 0 bottom
JP1068  [1X01_SMD_1.27X0.635MM_NO_SILK]  56.01,26.16 0 bottom
JP1069  [1X01_SMD_1.27X0.635MM_NO_SILK]  56.01,24.89 0 bottom
JP1070  [1X01_SMD_1.27X0.635MM_NO_SILK]  56.01,23.62 0 bottom
JP1071  [1X01_SMD_1.27X0.635MM_NO_SILK]  56.01,22.35 0 bottom
JP1072  [1X01_SMD_1.27X0.635MM_NO_SILK]  56.01,21.08 0 bottom
JP1073  [1X01_SMD_1.27X0.635MM_NO_SILK]  56.01,19.81 0 bottom
JP1074  [1X01_SMD_1.27X0.635MM_NO_SILK]  56.01,18.54 0 bottom
JP1075  [1X01_SMD_1.27X0.635MM_NO_SILK]  56.01,17.27 0 bottom
JP1076  [1X01_SMD_1.27X0.635MM_NO_SILK]  56.01,16 0 bottom
JP1077  [1X01_SMD_1.27X0.635MM_NO_SILK]  56.01,14.73 0 bottom
JP1078  [1X01_SMD_1.27X0.635MM_NO_SILK]  56.01,13.46 0 bottom
JP1079  [1X01_SMD_1.27X0.635MM_NO_SILK]  56.01,12.19 0 bottom
JP1080  [1X01_SMD_1.27X0.635MM_NO_SILK]  56.01,10.92 0 bottom
JP1081  [1X01_SMD_1.27X0.635MM_NO_SILK]  57.78,85.85 0 bottom
JP1082  [1X01_SMD_1.27X0.635MM_NO_SILK]  57.78,84.58 0 bottom
JP1083  [1X01_SMD_1.27X0.635MM_NO_SILK]  57.78,83.31 0 bottom
JP1084  [1X01_SMD_1.27X0.635MM_NO_SILK]  57.78,82.04 0 bottom
JP1085  [1X01_SMD_1.27X0.635MM_NO_SILK]  57.78,80.77 0 bottom
JP1086  [1X01_SMD_1.27X0.635MM_NO_SILK]  57.78,79.5 0 bottom
JP1087  [1X01_SMD_1.27X0.635MM_NO_SILK]  57.78,78.23 0 bottom
JP1088  [1X01_SMD_1.27X0.635MM_NO_SILK]  57.78,76.96 0 bottom
JP1089  [1X01_SMD_1.27X0.635MM_NO_SILK]  57.78,75.69 0 bottom
JP1090  [1X01_SMD_1.27X0.635MM_NO_SILK]  57.78,74.42 0 bottom
JP1091  [1X01_SMD_1.27X0.635MM_NO_SILK]  57.78,73.15 0 bottom
JP1092  [1X01_SMD_1.27X0.635MM_NO_SILK]  57.78,71.88 0 bottom
JP1093  [1X01_SMD_1.27X0.635MM_NO_SILK]  57.78,70.61 0 bottom
JP1094  [1X01_SMD_1.27X0.635MM_NO_SILK]  57.78,69.34 0 bottom
JP1095  [1X01_SMD_1.27X0.635MM_NO_SILK]  57.78,68.07 0 bottom
JP1096  [1X01_SMD_1.27X0.635MM_NO_SILK]  57.78,66.8 0 bottom
JP1097  [1X01_SMD_1.27X0.635MM_NO_SILK]  57.78,65.53 0 bottom
JP1098  [1X01_SMD_1.27X0.635MM_NO_SILK]  57.78,64.26 0 bottom
JP1099  [1X01_SMD_1.27X0.635MM_NO_SILK]  57.78,62.99 0 bottom
JP1100  [1X01_SMD_1.27X0.635MM_NO_SILK]  57.78,61.72 0 bottom
JP1101  [1X01_SMD_1.27X0.635MM_NO_SILK]  57.78,60.45 0 bottom
JP1102  [1X01_SMD_1.27X0.635MM_NO_SILK]  57.78,59.18 0 bottom
JP1103  [1X01_SMD_1.27X0.635MM_NO_SILK]  57.78,57.91 0 bottom
JP1104  [1X01_SMD_1.27X0.635MM_NO_SILK]  57.78,56.64 0 bottom
JP1105  [1X01_SMD_1.27X0.635MM_NO_SILK]  57.78,55.37 0 bottom
JP1106  [1X01_SMD_1.27X0.635MM_NO_SILK]  57.78,54.1 0 bottom
JP1107  [1X01_SMD_1.27X0.635MM_NO_SILK]  57.78,52.83 0 bottom
JP1108  [1X01_SMD_1.27X0.635MM_NO_SILK]  57.78,51.56 0 bottom
JP1109  [1X01_SMD_1.27X0.635MM_NO_SILK]  57.78,50.29 0 bottom
JP1110  [1X01_SMD_1.27X0.635MM_NO_SILK]  57.78,49.02 0 bottom
JP1111  [1X01_SMD_1.27X0.635MM_NO_SILK]  57.78,47.75 0 bottom
JP1112  [1X01_SMD_1.27X0.635MM_NO_SILK]  57.78,46.48 0 bottom
JP1113  [1X01_SMD_1.27X0.635MM_NO_SILK]  57.78,45.21 0 bottom
JP1114  [1X01_SMD_1.27X0.635MM_NO_SILK]  57.78,43.94 0 bottom
JP1115  [1X01_SMD_1.27X0.635MM_NO_SILK]  57.78,42.67 0 bottom
JP1116  [1X01_SMD_1.27X0.635MM_NO_SILK]  57.78,41.4 0 bottom
JP1117  [1X01_SMD_1.27X0.635MM_NO_SILK]  57.78,40.13 0 bottom
JP1118  [1X01_SMD_1.27X0.635MM_NO_SILK]  57.78,38.86 0 bottom
JP1119  [1X01_SMD_1.27X0.635MM_NO_SILK]  57.78,37.59 0 bottom
JP1120  [1X01_SMD_1.27X0.635MM_NO_SILK]  57.78,36.32 0 bottom
JP1121  [1X01_SMD_1.27X0.635MM_NO_SILK]  57.78,22.35 0 bottom
JP1122  [1X01_SMD_1.27X0.635MM_NO_SILK]  57.78,21.08 0 bottom
JP1123  [1X01_SMD_1.27X0.635MM_NO_SILK]  57.78,19.81 0 bottom
JP1124  [1X01_SMD_1.27X0.635MM_NO_SILK]  57.78,18.54 0 bottom
JP1125  [1X01_SMD_1.27X0.635MM_NO_SILK]  57.78,17.27 0 bottom